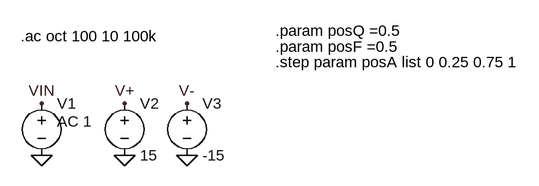
[diagram p0: schematic douxchamps_bell.asc]
douxchamps_bell.asc, the LTspice schematic file:
Version 4.1
SHEET 1 1092 1212
FLAG -448 -1008 VIN
FLAG -448 -928 0
FLAG -320 -928 0
FLAG -224 -928 0
FLAG -320 -1008 V+
FLAG -224 -1008 V-
SYMBOL voltage -448 -1024 R0
WINDOW 123 24 44 Left 2
WINDOW 39 0 0 Left 0
SYMATTR Value2 AC 1
SYMATTR InstName V1
SYMATTR Value ""
SYMBOL voltage -320 -1024 R0
SYMATTR InstName V2
SYMATTR Value 15
SYMBOL voltage -224 -1024 R0
SYMATTR InstName V3
SYMATTR Value -15
TEXT -480 -1112 Left 2 !.ac oct 100 10 100k
TEXT -88 -1120 Left 2 !.param posQ =0.5
TEXT -88 -1096 Left 2 !.param posF =0.5
TEXT -88 -1072 Left 2 !.step param posA list 0 0.25 0.75 1

The netlist it stands for:
* douxchamps_bell.asc
V1 VIN 0 AC 1
V2 V+ 0 15
V3 V- 0 -15
.ac oct 100 10 100k
.param posQ =0.5
.param posF =0.5
.step param posA list 0 0.25 0.75 1
.backanno
.end